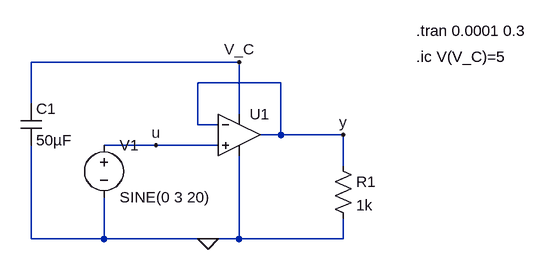
[diagram p0: schematic opamp_RC_universal.asc]
opamp_RC_universal.asc, the LTspice schematic file:
Version 4
SHEET 1 880 680
WIRE 240 144 -80 144
WIRE 304 176 176 176
WIRE -80 208 -80 144
WIRE 240 224 240 144
WIRE 176 240 176 176
WIRE 208 240 176 240
WIRE 304 256 304 176
WIRE 304 256 272 256
WIRE 400 256 304 256
WIRE 112 272 32 272
WIRE 208 272 112 272
WIRE 400 304 400 256
WIRE -80 416 -80 272
WIRE 32 416 32 352
WIRE 32 416 -80 416
WIRE 192 416 32 416
WIRE 240 416 240 288
WIRE 240 416 192 416
WIRE 400 416 400 384
WIRE 400 416 240 416
FLAG 192 416 0
FLAG 400 256 y
FLAG 112 272 u
FLAG 240 144 V_C
SYMBOL cap -96 208 R0
SYMATTR InstName C1
SYMATTR Value 50µF
SYMBOL voltage 32 256 R0
SYMATTR InstName V1
SYMATTR Value SINE(0 3 20)
SYMBOL res 384 288 R0
SYMATTR InstName R1
SYMATTR Value 1k
SYMBOL Opamps/UniversalOpamp2 240 256 R0
SYMATTR InstName U1
TEXT 512 136 Left 2 !.ic V(V_C)=5
TEXT 512 96 Left 2 !.tran 0.0001 0.3

The netlist it stands for:
* opamp_RC_universal.asc
C1 V_C 0 50µF
V1 u 0 SINE(0 3 20)
R1 y 0 1k
XU1 u y V_C 0 y level.2 Avol=1Meg GBW=10Meg Slew=10Meg ilimit=25m rail=0 Vos=0 phimargin=45 en=0 enk=0 in=0 ink=0 Rin=500Meg  ; pins IN+ IN- V+ V- OUT
.ic V(V_C)=5
.tran 0.0001 0.3
.lib UniversalOpamps2.sub
.backanno
.end